# EAGLE design Tau-BOTTOM (EAGLE 9.5.2)
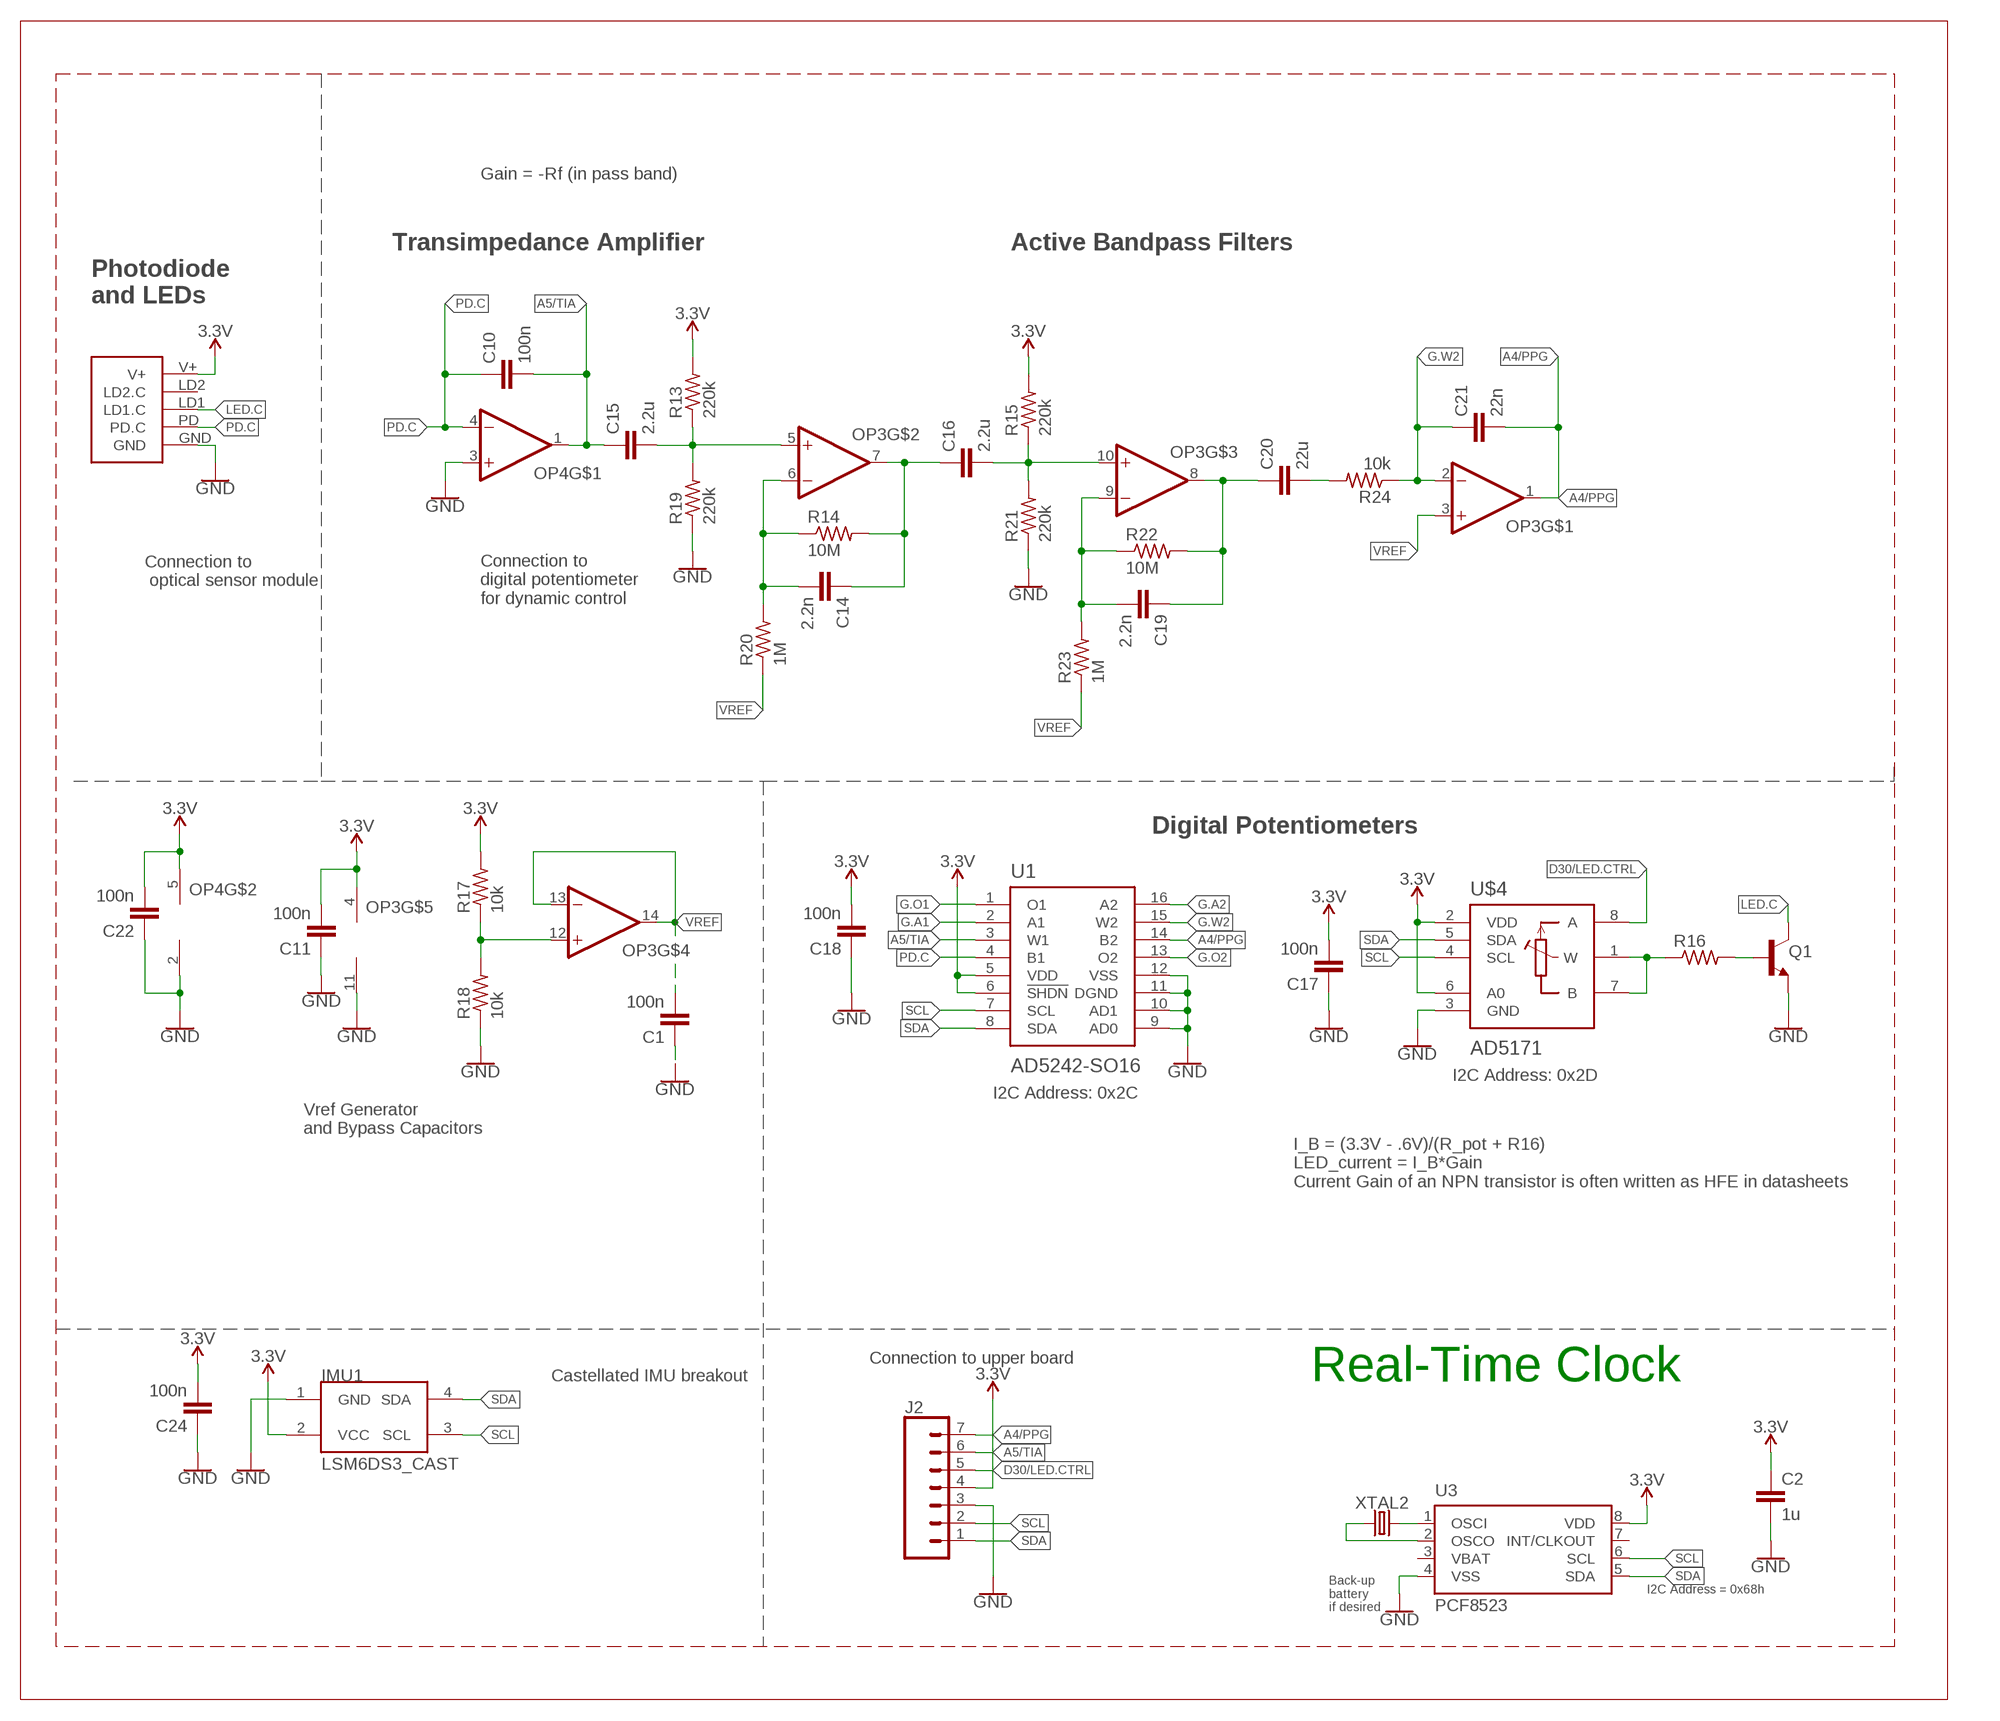
[diagram p0: schematic, sheet 1]

## Parts
C1  100n  CAPACITOR0603  [C0603]
C2  1u  CAPACITOR0603  [C0603]
C10  100n  CAPACITOR0603  [C0603]
C11  100n  CAPACITOR0603  [C0603]
C14  2.2n  CAPACITOR0603  [C0603]
C15  2.2u  CAPACITOR0603  [C0603]
C16  2.2u  CAPACITOR0603  [C0603]
C17  100n  CAPACITOR0603  [C0603]
C18  100n  CAPACITOR0603  [C0603]
C19  2.2n  CAPACITOR0603  [C0603]
C20  22u  CAPACITOR0603  [C0603]
C21  22n  CAPACITOR0603  [C0603]
C22  100n  CAPACITOR0603  [C0603]
C24  100n  CAPACITOR0603  [C0603]
IMU1  LSM6DS3_CAST  [LSM6DS3_CAST]
J2  CONN_07-1.27MM  [1X07_1.27MM]
OP3  OP-QUAD-SO14  [SO14]
OP4  OP-SINGLEOT  [SOT23-5]
Q1  NPN-GENERIC  [SOT23-3]
R13  220k  RESISTOR0603  [R0603]
R14  10M  RESISTOR0603  [R0603]
R15  220k  RESISTOR0603  [R0603]
R16  RESISTOR0603  [R0603]
R17  10k  RESISTOR0402  [R0402]
R18  10k  RESISTOR0402  [R0402]
R19  220k  RESISTOR0603  [R0603]
R20  1M  RESISTOR0603  [R0603]
R21  220k  RESISTOR0603  [R0603]
R22  10M  RESISTOR0603  [R0603]
R23  1M  RESISTOR0603  [R0603]
R24  10k  RESISTOR0603  [R0603]
U1  AD5242-SO16  [SO16]
U3  PCF8523  [SO8]
U$3  PPG.MODULE.2  [PPG.MODULE.2]
U$4  AD5171  [SOT-23-8]
XTAL2  32.7680kHz  CRYSTALECS-.327-12.5-12-C-TR  [2-SMD.NOLEAD.2.0MMTO1.2MM]

## Nets
3.3V: C2.1 C11.2 C17.2 C18.2 C22.2 C24.2 IMU1.2(VCC) J2.4 OP3.4(V+) OP4.5(V+) R13.2 R15.2 R17.2 U1.5(VDD) U1.6(!SHDN) U3.8(VDD) U$3.V+ U$4.2(VDD) U$4.6(A0)
A4/PPG: C21.2 J2.7 OP3.1(OUT) U1.14(B2)
A5/TIA: C10.2 C15.1 J2.6 OP4.1(OUT) U1.3(W1)
D30/LED.CTRL: J2.5 U$4.8(A)
G.A1: U1.2(A1)
G.A2: U1.16(A2)
G.O1: U1.1(O1)
G.O2: U1.13(O2)
G.W2: C21.1 OP3.2(-IN) R24.1 U1.15(W2)
GND: C1.1 C2.2 C11.1 C17.1 C18.1 C22.1 C24.1 IMU1.1(GND) J2.3 OP3.11(V-) OP4.2(V-) OP4.3(+IN) Q1.2(E) R18.1 R19.1 R21.1 U1.9(AD0) U1.10(AD1) U1.11(DGND) U1.12(VSS) U3.4(VSS) U$3.GND U$4.3(GND)
LED.C: Q1.3(C) U$3.LD1(LD1.C)
N$4: U3.1(OSCI) XTAL2.P$2
N$8: Q1.1(B) R16.2
N$9: R16.1 U$4.1(W) U$4.7(B)
N$10: OP3.12(+IN) R17.1 R18.2
N$12: U3.2(OSCO) XTAL2.P$1
N$13: C15.2 OP3.5(+IN) R13.1 R19.2
N$15: C14.2 OP3.6(-IN) R14.1 R20.2
N$16: C14.1 C16.1 OP3.7(OUT) R14.2
N$17: C16.2 OP3.10(+IN) R15.1 R21.2
N$18: C19.2 OP3.9(-IN) R22.1 R23.2
N$19: C19.1 C20.1 OP3.8(OUT) R22.2
N$20: C20.2 R24.2
PD.C: C10.1 OP4.4(-IN) U1.4(B1) U$3.PD(PD.C)
SCL: IMU1.3(SCL) J2.2 U1.7(SCL) U3.6(SCL) U$4.4(SCL)
SDA: IMU1.4(SDA) J2.1 U1.8(SDA) U3.5(SDA) U$4.5(SDA)
VREF: C1.2 OP3.3(+IN) OP3.13(-IN) OP3.14(OUT) R20.1 R23.1
Unconnected: U3.7(INT/CLKOUT) U$3.LD2(LD2.C)

## Notes on the sheet
- Gain = -Rf (in pass band)
- Transimpedance Amplifier | Active Bandpass Filters
- Photodiode
  and LEDs
- Connection to
   optical sensor module
- Connection to 
  digital potentiometer
  for dynamic control
- Digital Potentiometers
- I2C Address: 0x2D
- I2C Address: 0x2C
- Vref Generator 
  and Bypass Capacitors
- I_B = (3.3V - .6V)/(R_pot + R16)
  LED_current = I_B*Gain
  Current Gain of an NPN transistor is often written as HFE in datasheets
- Connection to upper board
- Castellated IMU breakout | Real-Time Clock
- I2C Address = 0x68h
- Back-up
  battery
  if desired

## Power pins joined to a net without a drawn wire
VBAT: U3.3(VBAT)

## Library data of the parts
C1 C2 C10 C11 C14-C22 C24 = LinnesLab-Passives:CAPACITOR
IMU1 = LinnesLab-Sensors:LSM6DS3_CAST
J2 = LinnesLab-Connectors:CONN_07: Multi connection point. Often used as Generic Header-pin footprint for 0.1 inch spaced/style header connections On any of the 0.1 inch spaced packages, you can populate with these: Break Away Headers - Straight <https://www.sparkfun.com/products/116> (PRT-00116) Break Away Male Headers - Right Angle <https://www.sparkfun.com/products/553> (PRT-00553) Female Headers <https://www.sparkfun.com/products/115> (PRT-00115) Break Away Headers - Machine Pin <https://www.sparkfun.com/products/117> (PRT-00117) Break Away Female Headers - Swiss Machine Pin <https://www.sparkfun.com/products/743> (PRT-00743) For SCREWTERMINALS and SPRING TERMINALS visit here: Screw Terimnals on SparkFun.com <https://www.sparkfun.com/search/results?term=Screw+Terminals> (5mm/3.5mm/2.54mm spacing) This device is also useful as a general connection point to wire up your design to another part of your project. Our various solder wires solder well into these plated through hole pads. Hook-Up Wire - Assortment (Stranded, 22 AWG) <https://www.sparkfun.com/products/11375> (PRT-11375) Hook-Up Wire - Assortment (Solid Core, 22 AWG) <https://www.sparkfun.com/products/11367> (PRT-11367) View the entire wire category on our website here <https://www.sparkfun.com/categories/141> Special notes: Molex polarized connector foot print use with SKU : PRT-08231 with associated crimp pins and housings. 1MM SMD Version SKU: PRT-10208 NOTES ON THE VARIANTS LOCK and LOCK_LONGPADS... This footprint was designed to help hold the alignment of a through-hole component (i.e. 6-pin header) while soldering it into place. You may notice that each hole has been shifted either up or down by 0.005 of an inch from it's more standard position (which is a perfectly straight line). This slight alteration caused the pins (the squares in the middle) to touch the edges of the holes. Because they are alternating, it causes a "brace" to hold the component in place. 0.005 has proven to be the perfect amount of "off-center" position when using our standard breakaway headers. Although looks a little odd when you look at the bare footprint, once you have a header in there, the alteration is very hard to notice. Also,if you push a header all the way into place, it is covered up entirely on the bottom side.
OP3 = LinnesLab-AnalogIC:OP-QUAD: General symbol and footprints for Quad Op Amps. Use with any standard general purpose op amp.
OP4 = LinnesLab-AnalogIC:OP-SINGLE: Single Op Amp 2.7V to 6.0V Single Supply CMOS Source: http://ww1.microchip.com/downloads/en/DeviceDoc/21314g.pdf
Q1 = LinnesLab-DiscreteSemi:NPN
R13-R24 = LinnesLab-Passives:RESISTOR
U1 = LinnesLab-DigitalIC:AD5242
U3 = LinnesLab-Clocks:PCF8523; DIGIKEY: 568-5306-1-ND; I2C_ADDRESS: 0x68h; MFN: PCF8523T/1,118; MFN_MANUFACTURER: NXP USA Inc.
U$3 = LinnesLab-Connectors:PPG.MODULE.2: Digi-Key Part Number: S9014E-50-ND Manufacturer Part Number: GRPB501VWVN-RC Description: 1mm insulation height 0.05in pitch 50 positions
U$4 = LinnesLab-DigitalIC:AD5171
XTAL2 = LinnesLab-Clocks:CRYSTAL

## Board
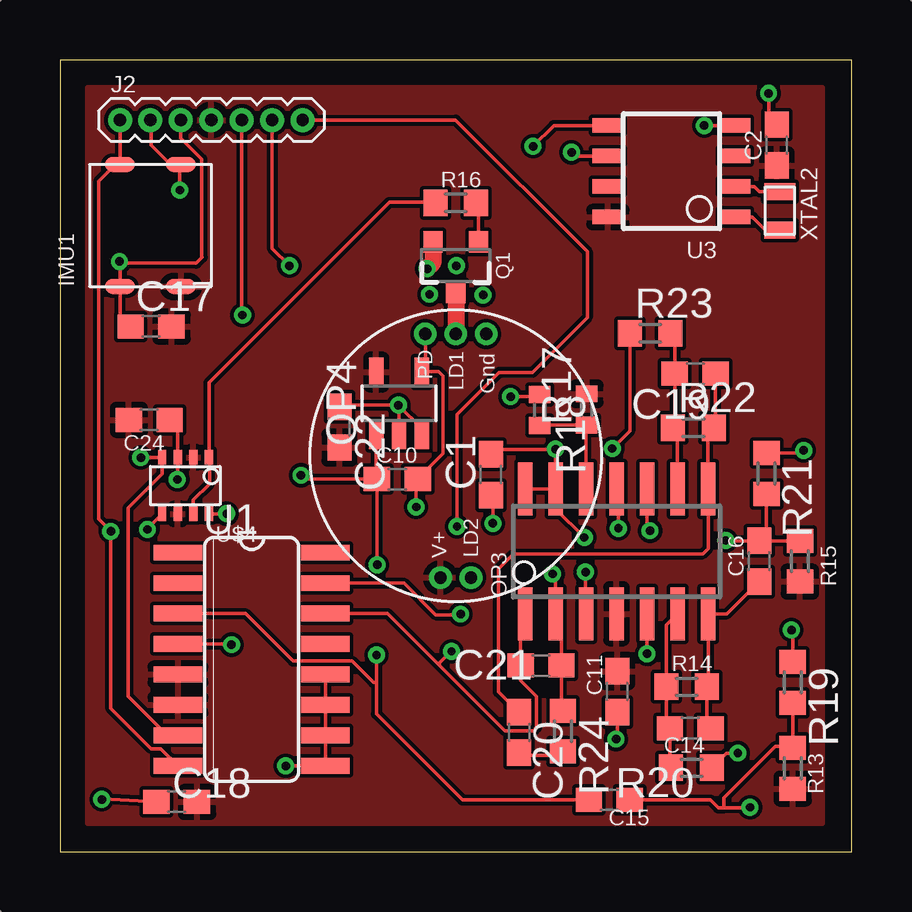
[diagram p1: board, top side]
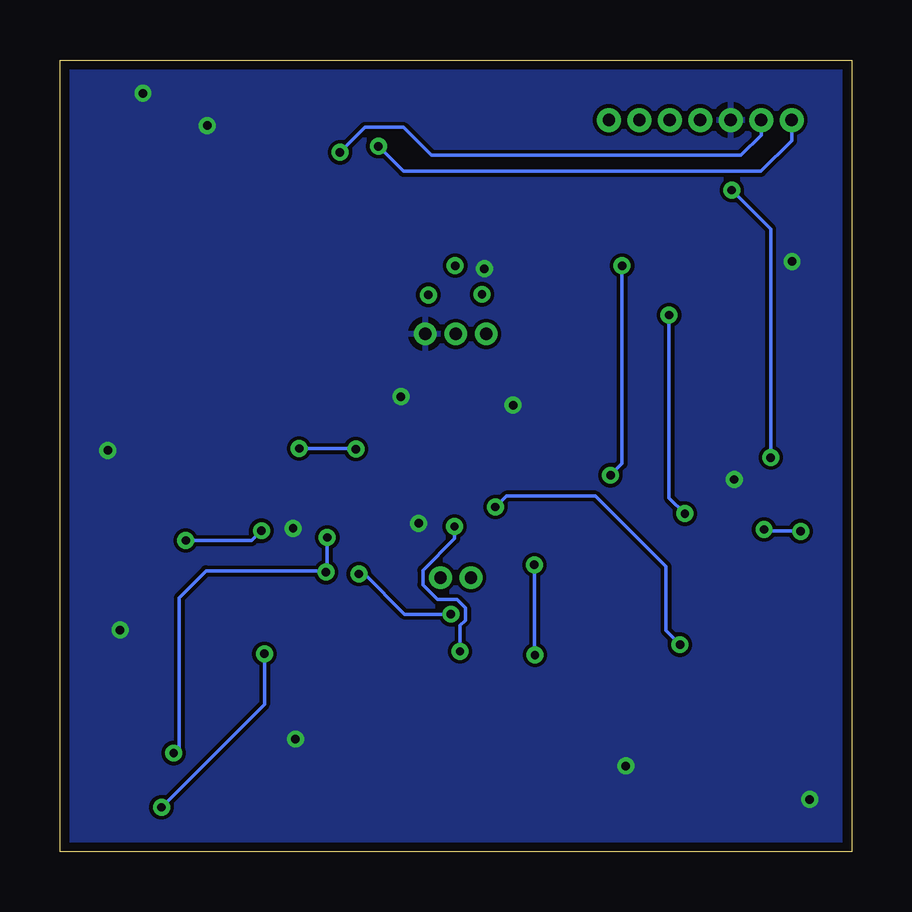
[diagram p2: board, bottom side, seen from below]

Size 33 x 33 mm. Coordinates in mm from the lower left corner, seen from the top.
Outline: 0,0 33,0 33,33 0,33 0,0
Copper layers (1*16): Top 0.0356mm / dielectric 1.5011mm / Bottom 0.0356mm
Design rules "LaenPCBOrder": minimum track width 6mil, minimum drill 13mil, track to track 6mil, track to pad 6mil, pad to pad 6mil, via to via 6mil, smd to smd 6mil, copper to edge 15mil, drill to drill 6mil, minimum pad ring 7mil, minimum via ring 7mil, stop-mask expansion 3mil, vias tented up to drill 0mil, thermal gap 10mil

### Footprints (pad centres in the part's own frame; a part is rotated, then mirrored left to right if it is on the bottom)
C0603 = smd 1.1 x 1: 1 -0.85,0; 2 0.85,0
LSM6DS3_CAST = smd 0.635 x 1.27: 1 -2.54,1.27; 2 -2.54,-1.27; 3 2.54,-1.27; 4 2.54,1.27
1X07_1.27MM = drill 0.508 pad 1: 1 0,0; 2 1.27,0; 3 2.54,0; 4 3.81,0; 5 5.08,0; 6 6.35,0; 7 7.62,0
SO14 = smd 0.6 x 2.2: 1 -3.81,-2.6; 2 -2.54,-2.6; 3 -1.27,-2.6; 4 0,-2.6; 5 1.27,-2.6; 6 2.54,-2.6; 7 3.81,-2.6; 8 3.81,2.6; 9 2.54,2.6; 10 1.27,2.6; 11 0,2.6; 12 -1.27,2.6; 13 -2.54,2.6; 14 -3.81,2.6
SOT23-5 = smd 0.6 x 1.2: 1 -0.95,-1.306; 2 0,-1.306; 3 0.95,-1.306; 4 0.95,1.306; 5 -0.95,1.306
SOT23-3 = smd 0.8 x 0.9: 1 -0.95,-1; 2 0.95,-1; 3 0,1.1
R0603 = smd 1 x 1.1: 1 -0.85,0; 2 0.85,0
R0402 = smd 0.7 x 0.9: 1 -0.65,0; 2 0.65,0
SO16 = smd 0.66 x 2.032: 1 -4.445,-3.073; 2 -3.175,-3.073; 3 -1.905,-3.073; 4 -0.635,-3.073; 5 0.635,-3.073; 6 1.905,-3.073; 7 3.175,-3.073; 8 4.445,-3.073; 9 4.445,3.073; 10 3.175,3.073; 11 1.905,3.073; 12 0.635,3.073; 13 -0.635,3.073; 14 -1.905,3.073; 15 -3.175,3.073; 16 -4.445,3.073
SO8 = smd 1.3 x 0.6: 1 -2.65,1.905; 2 -2.65,0.635; 3 -2.65,-0.635; 4 -2.65,-1.905; 5 2.65,-1.905; 6 2.65,-0.635; 7 2.65,0.635; 8 2.65,1.905
PPG.MODULE.2 = drill 0.508 pad 0.94: GND 1.27,5.08; LD1 0,5.08; LD2 0.635,-5.08; PD -1.27,5.08; V+ -0.635,-5.08
SOT-23-8 = smd 0.35 x 0.6: 1 -0.991,-1.176; 2 -0.341,-1.176; 3 0.309,-1.176; 4 0.959,-1.176; 5 0.959,1.176; 6 0.309,1.176; 7 -0.341,1.176; 8 -0.991,1.176
2-SMD.NOLEAD.2.0MMTO1.2MM = smd 0.7 x 1.3: P$1 -0.8,0; P$2 0.8,0

### Placement (x,y rotation side)
C1  17.97,15.71 90 top
C2  29.88,29.45 90 top
C10  14.06,15.53 180 top
C11  23.23,6.67 90 top
C14  26.28,5.15 180 top
C15  22.9,2.15 0 top
C16  29.15,12.11 90 top
C17  3.8,21.88 0 top
C18  4.87,2.07 0 top
C19  26.48,19.93 180 top
C20  19.14,4.97 270 top
C21  20.06,7.76 180 top
C22  11.65,17.69 270 top
C24  3.72,18 180 top
IMU1  3.77,26.1 90 top
J2  2.5,30.5 0 top
OP3  23.2,12.51 0 top
OP4  14.14,18.68 0 top
Q1  16.5,24.42 180 top
R13  30.55,3.47 270 top
R14  26.13,6.87 0 top
R15  30.85,12.11 270 top
R16  16.5,27.04 0 top
R17  21.96,18.43 90 top
R18  20,18.4 270 top
R19  30.55,7.05 270 top
R20  26.33,3.49 180 top
R21  29.45,15.76 270 top
R22  26.41,17.67 0 top
R23  24.6,21.6 0 top
R24  20.97,5.02 270 top
U1  7.99,8.02 270 top
U3  25.49,28.36 180 top
U$3  16.5,16.5 0 top
U$4  5.22,15.25 180 top
XTAL2  30.01,26.71 270 top

### Tracks (layer width: path | path; a pad name or v marks a point on that pad's centre or on a via)
3.3V
  pour Top: 1.16,31.84 31.79,31.84 31.79,1.18 1.16,1.18
A4/PPG  (via drill 0.35)
  Top 0.152: OP3.1 19.2,9.72 C21.2 19.2,7.13 19.87,6.46 19.87,5.17 19.73,5.04 18.55,5.04 15.83,7.75 | U1.14 13.66,9.92 15.83,7.75 | J2.7 16.49,30.5 21.99,25.01 21.99,22.27 19.7,19.98 18.3,19.98 16.55,18.23 v16.55,13.55 | v16.32,8.35 15.83,7.86 15.83,7.75
  Bottom 0.152: v16.55,13.55 16.55,13.05 17.87,11.72 17.87,11.12 17.26,10.5 16.45,10.5 16.1,10.15 16.1,9.64 16.32,9.42 v16.32,8.35
A5/TIA  (via drill 0.35)
  Top 0.152: OP4.1 13.19,15.56 C10.2 | C10.2 13.21,11.96 v13.22,11.95 | v13.2,8.19 13.2,7.05 | 13.2,7.05 13.2,5.73 16.78,2.15 C15.1 | J2.6 8.85,25.14 v9.56,24.42 | v10.05,15.69 10.2,15.53 C10.2 | U1.3 7.74,9.92 9.72,7.94 12.17,7.94 13.06,7.05 13.2,7.05
  Bottom 0.152: v13.22,11.95 13.22,8.22 v13.2,8.19 | v9.56,24.42 9.56,16.17 v10.05,15.69
D30/LED.CTRL  (via drill 0.35)
  Top 0.152: J2.5 7.58,22.4 v7.61,22.37 | v6.95,14.09 6.94,14.08 U$4.8
  Bottom 0.152: v7.61,22.37 7.61,14.75 v6.95,14.09
G.W2  (via drill 0.35)
  Top 0.152: R24.1 20.95,5.89 20.91,5.93 C21.1 20.91,9.67 OP3.2 20.66,11.45 v20.54,11.57 | U1.15 14.34,11.19 15.66,9.87 16.68,9.87 v16.7,9.89
  Bottom 0.152: v16.7,9.89 18.63,9.89 20.31,11.57 v20.54,11.57
GND  (via drill 0.35)
  Top 0.152: R18.1 19.91,18.96 v18.79,18.96 | OP3.11 23.28,15.04 v23.28,13.48 | R21.1 30.89,16.61 v31,16.73 | C18.1 1.77,2.2 v1.74,2.17 | R19.1 30.55,9.18 v30.49,9.23 | C11.1 23.23,4.74 v23.18,4.69 | OP4.2 14.14,18.58 | 14.14,18.58 v14.11,18.61 11.85,18.61 C22.1 | U1.12 U1.11 U1.10 U1.9 v9.41,3.57 | 2.5,24.58 IMU1.1 2.5,22.33 C17.1 | 2.5,24.58 v2.48,24.6 | C24.1 4.91,17.66 U$4.3 4.91,15.53 v4.89,15.51 | C1.1 18.05,14.79 v18.05,13.68 | OP4.3 15.09,17.63 14.14,18.58 | J2.3 5.04,29.73 5.91,28.87 5.91,24.8 5.93,24.78 5.68,24.53 2.55,24.53 2.5,24.58 | C2.2 29.54,30.3 v29.54,31.61 | v26.86,30.27 U3.4
  Top 0.711: Q1.2 15.55,24.54 v15.3,24.3
  pour Bottom: 0.34,32.81 32.7,32.81 32.7,0.19 0.34,0.19
LED.C
  Top 0.711: Q1.3 U$3.LD1
N$1  (via drill 0.35)
  other vias: 15.41,23.23
N$2  (via drill 0.35)
  other vias: 17.64,23.2
N$3  (via drill 0.35)
  other vias: 16.52,24.42
N$4
  Top 0.152: XTAL2.P$2 29.41,25.91 28.87,26.46 U3.1
N$8
  Top 0.152: R16.2 17.45,26.94 Q1.1
N$9
  Top 0.152: U$4.7 5.56,14.66 6.24,15.33 6.24,16.41 U$4.1 6.21,19.55 13.73,27.07 15.62,27.07 R16.1
N$10
  Top 0.152: R18.2 20.03,17.78 R17.1 21.93,17.75 OP3.12
N$12
  Top 0.152: XTAL2.P$1 29.16,27.51 28.95,27.73 U3.2
N$13  (via drill 0.35)
  Top 0.152: R13.1 30.55,4.38 | 30.55,4.38 R19.2 | C15.2 27.12,2.15 27.45,1.82 27.68,1.82 | 30.55,4.38 29.82,4.38 27.68,2.24 27.68,1.82 | OP3.5 v24.48,8.24 | v28.77,1.84 28.74,1.82 27.68,1.82
  Bottom 0.152: v24.48,8.24 24.48,6.14 v28.77,1.84
N$15
  Top 0.152: R20.2 25.43,3.54 C14.2 25.28,5.3 R14.1 25.28,9.44 OP3.6
N$16
  Top 0.152: C14.1 26.98,5.3 R14.2 27.03,6.92 27.03,9.9 OP3.7 27.8,9.91 C16.1
N$17  (via drill 0.35)
  Top 0.152: R15.1 29.17,12.96 | 29.17,12.96 C16.2 27.77,12.96 v27.76,12.97 | v24.6,13.38 24.48,13.5 OP3.10 | R21.2 29.45,13.23 29.17,12.96
  Bottom 0.152: v27.76,12.97 25.01,12.97 v24.6,13.38
N$18
  Top 0.152: OP3.9 25.75,17.48 R22.1 25.63,17.74 C19.2 25.63,21.43 R23.2
N$19
  Top 0.152: R22.2 27.25,17.64 | C19.1 27.33,17.72 27.25,17.64 | C20.1 19.11,5.82 18.28,6.66 18.28,11.78 18.91,12.41 26.79,12.41 27.02,12.64 27.02,15.2 | OP3.8 27.02,15.2 | 27.02,15.2 27.02,17.4 27.25,17.64
N$20
  Top 0.152: C20.2 19.24,4.02 20.82,4.02 R24.2
PD.C  (via drill 0.35)
  Top 0.152: U$3.PD 15.23,20.13 15.1,20 | 15.1,20 OP4.4 | 15.1,20 15.79,20 15.97,19.83 15.97,16.59 C10.1 14.85,15.47 v14.85,14.37 | U1.4 7.13,8.65 v7.15,8.62
  Bottom 0.152: v7.15,8.62 7.74,9.21 7.74,11.88 10.68,14.82 14.39,14.82 v14.85,14.37
SCL  (via drill 0.35)
  Top 0.152: U1.7 4.46,4.84 2.83,6.47 2.83,14.32 4.26,15.75 U$4.4 3.38,16.43 v3.37,16.42 | J2.2 3.8,30.47 3.8,29.45 4.61,28.64 4.99,28.64 | 4.99,28.64 IMU1.3 | v4.99,27.57 4.99,28.64 | U3.6 21.48,29 v21.32,29.15
  Bottom 0.152: v3.37,16.42 3.37,25.95 v4.99,27.57 | v21.32,29.15 20.28,30.19 18.68,30.19 17.52,29.02 4.61,29.02 3.77,29.87 J2.2
SDA  (via drill 0.35)
  Top 0.152: J2.1 IMU1.4 2.3,28.64 1.62,27.95 1.62,13.86 v2.12,13.35 2.12,5.96 3.81,4.28 4.21,4.28 U1.8 | v3.65,13.43 3.65,13.46 U$4.5 | U3.5 20.59,30.27 v19.73,29.4
  Bottom 0.152: v2.12,13.35 2.15,13.38 3.6,13.38 v3.65,13.43 | v19.73,29.4 18.68,28.36 3.77,28.36 2.5,29.63 J2.1
VREF  (via drill 0.35)
  Top 0.152: R23.1 23.75,17.53 v23.03,16.8 | v20.66,16.78 20.66,16.75 | 20.66,16.75 OP3.13 | OP3.13 20.66,14.29 v21.86,13.1 | v21.91,11.65 21.91,9.94 OP3.3 | R20.1 27.79,4.1 v28.26,4.1 | C1.2 18.16,16.75 20.66,16.75 | OP3.14 OP3.13
  Bottom 0.152: v23.03,16.8 20.69,16.8 v20.66,16.78 | v21.86,13.1 21.86,11.7 | 21.86,11.7 v21.91,11.65 | v28.26,4.1 28.03,4.33 28.03,10.58 26.91,11.7 21.86,11.7